# Altium schematic sheet IDCI_WifiNode_BLK.SchDoc: WifiNoder_BLK
size A4; Author: Luciano Lopez; CompanyName: UTN-FRBA; Revision: 1; SheetNumber: 1; SheetTotal: 5
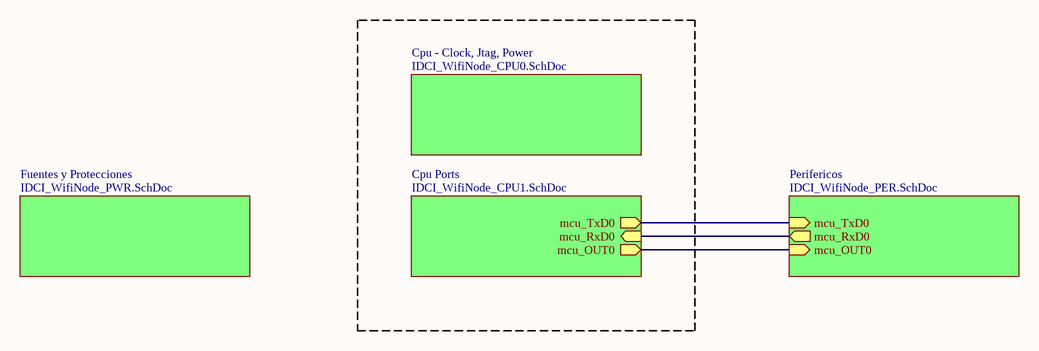
[diagram p0: IDCI_WifiNode_BLK.SchDoc]

## Sub-sheets
Cpu - Clock, Jtag, Power = IDCI_WifiNode_CPU0.SchDoc: no entries
Cpu Ports = IDCI_WifiNode_CPU1.SchDoc: mcu_TxD0 (out), mcu_RxD0 (in), mcu_OUT0 (out)
Fuentes y Protecciones = IDCI_WifiNode_PWR.SchDoc: no entries
Perifericos = IDCI_WifiNode_PER.SchDoc: mcu_TxD0 (in), mcu_RxD0 (out), mcu_OUT0 (in)

## Nets
(unnamed): sheet Cpu Ports/mcu_TxD0, sheet Perifericos/mcu_TxD0
(unnamed): sheet Cpu Ports/mcu_RxD0, sheet Perifericos/mcu_RxD0
(unnamed): sheet Cpu Ports/mcu_OUT0, sheet Perifericos/mcu_OUT0

## Notes on the sheet
- Title:
- Size:
- Author:
- A4
- Sheet
- of
- Revision:
- File:
- Date: